# EAGLE design fri3d-badge-2018 (EAGLE 8.5.1)
CNAME: Fri3d Camp Badge; CREVISION: 1.0; DESIGNER: Christophe VG

## Sheet 1 of 2
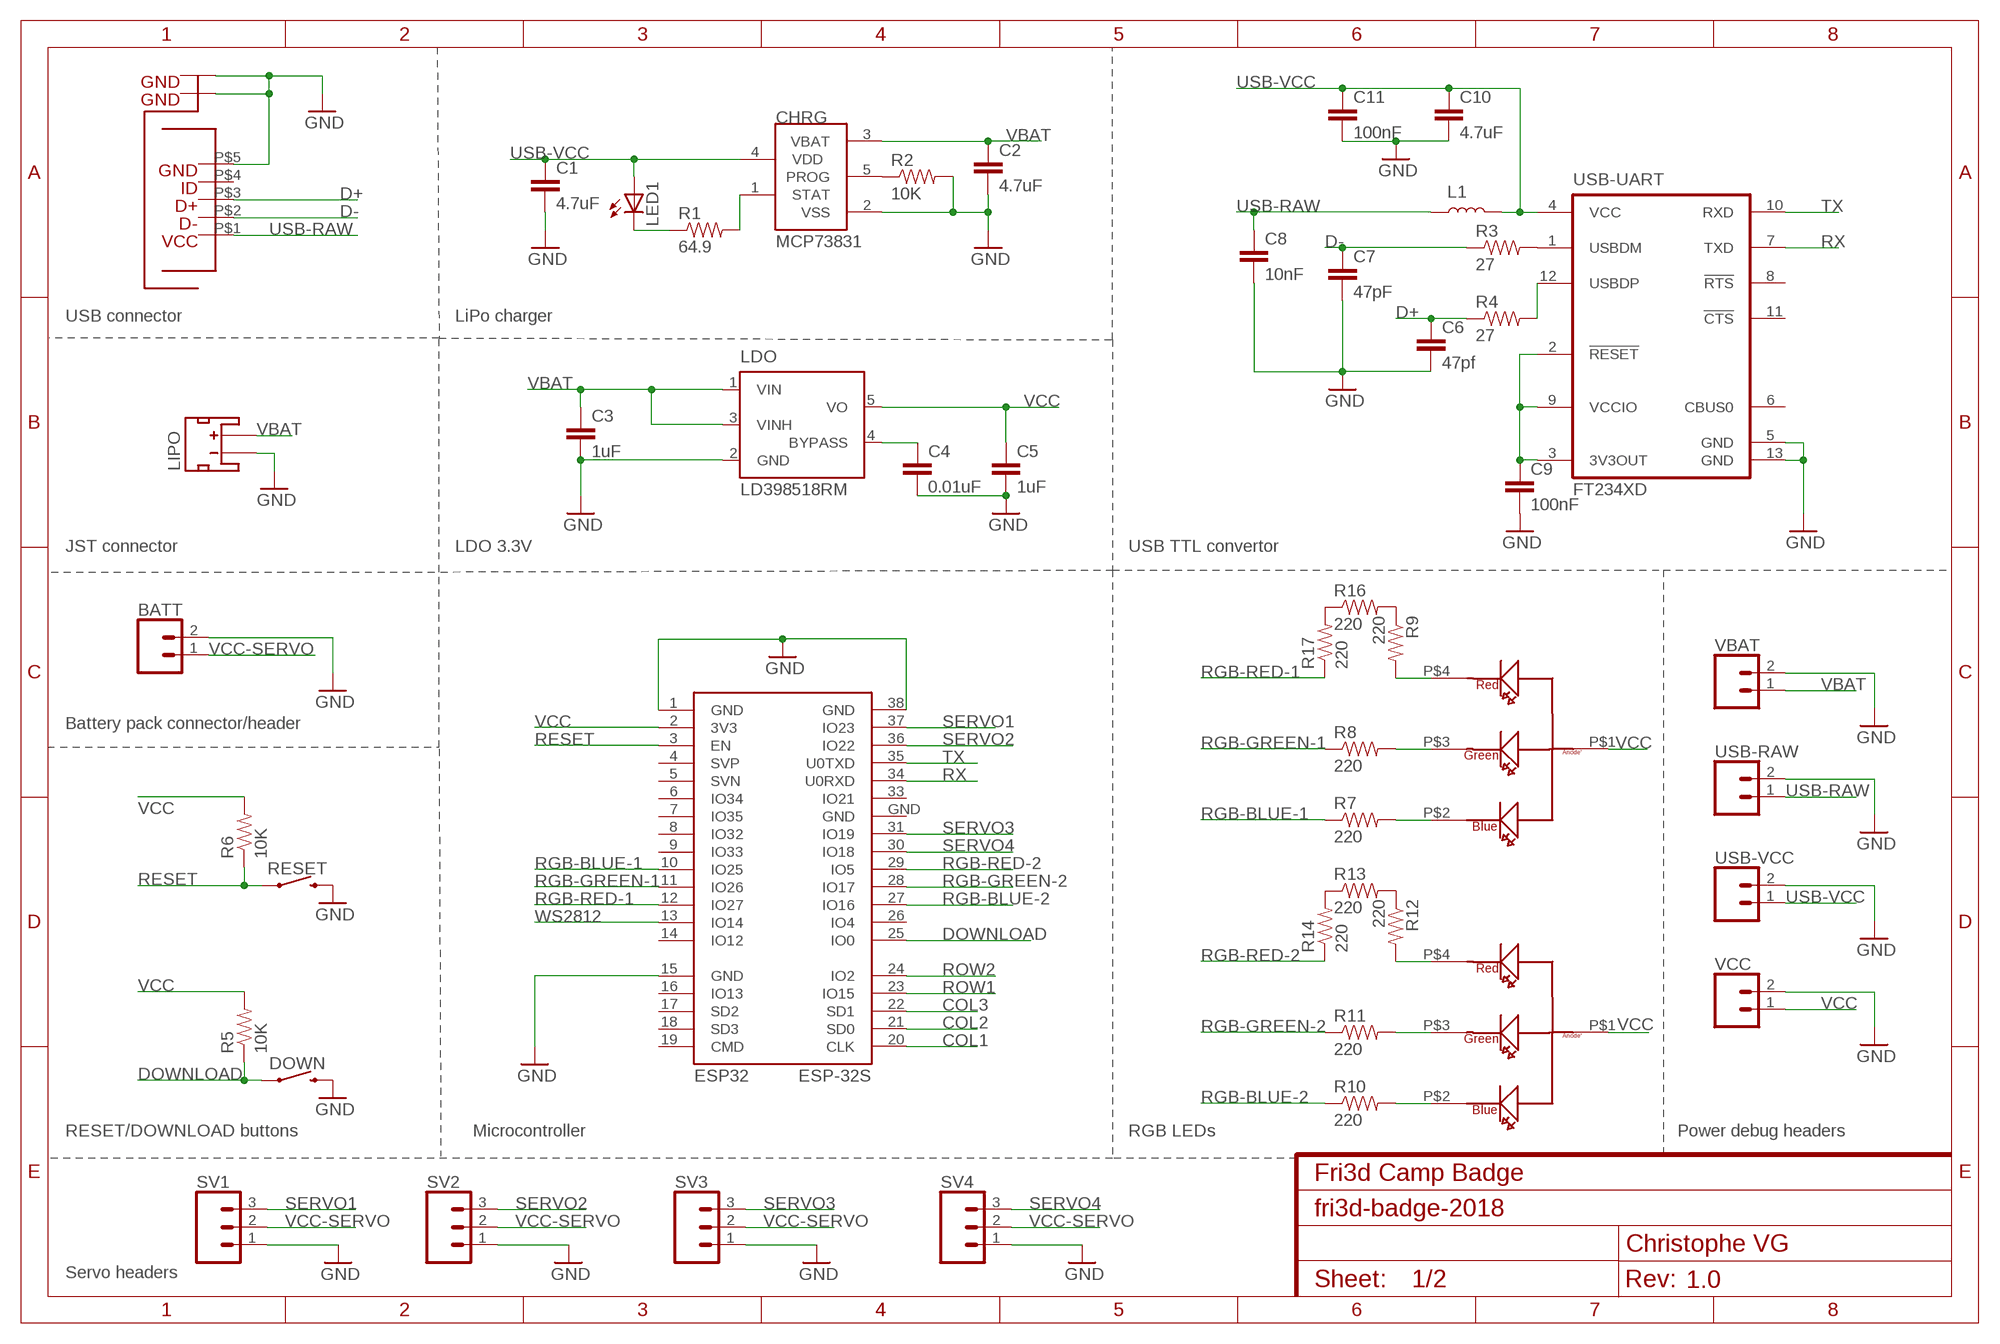
[diagram p0: schematic, sheet 1]

### Parts
BATT  CONN_02  [1X02]
C1  4.7uF  CAP0805  [0805]
C2  4.7uF  CAP0805  [0805]
C3  1uF  CAP0805  [0805]
C4  0.01uF  CAP0805  [0805]
C5  1uF  CAP0805  [0805]
C6  47pf  CAP0805  [0805]
C7  47pF  CAP0805  [0805]
C8  10nF  CAP0805  [0805]
C9  100nF  CAP0805  [0805]
C10  4.7uF  CAP0805  [0805]
C11  100nF  CAP0805  [0805]
CHRG  MCP73831  [SOT23-5L]
DOWN  MOMENTARY-SWITCH-SPST-PTH-6.0MM  [TACTILE_SWITCH_PTH_6.0MM]
ESP32  ESP-32S  [ESP-32S]
L1  INDUCTOR-0805-3.3UH  [0805]
LDO  LD398518RM  [SOT23-5L]
LED1  LEDCHIP-LED0805  [CHIP-LED0805]
LIPO  JST_2MM_MALE  [JST-2-SMD]
R1  64.9  RESISTOR0805-RES  [0805]
R2  10K  RESISTOR0805-RES  [0805]
R3  27  RESISTOR0805-RES  [0805]
R4  27  RESISTOR0805-RES  [0805]
R5  10K  RESISTOR0805-RES  [0805]
R6  10K  RESISTOR0805-RES  [0805]
R7  220  RESISTOR0805-RES  [0805]
R8  220  RESISTOR0805-RES  [0805]
R9  220  RESISTOR0805-RES  [0805]
R10  220  RESISTOR0805-RES  [0805]
R11  220  RESISTOR0805-RES  [0805]
R12  220  RESISTOR0805-RES  [0805]
R13  220  RESISTOR0805-RES  [0805]
R14  220  RESISTOR0805-RES  [0805]
R16  220  RESISTOR0805-RES  [0805]
R17  220  RESISTOR0805-RES  [0805]
RESET  MOMENTARY-SWITCH-SPST-PTH-6.0MM  [TACTILE_SWITCH_PTH_6.0MM]
SV1  CONN_03  [1X03]
SV2  CONN_03  [1X03]
SV3  CONN_03  [1X03]
SV4  CONN_03  [1X03]
U$1  DRAGAN-PERSONAL_AVAGO-RGB-LED  [DRAGAN-PERSONAL_AVAGO-RGB-LED]
U$4  DRAGAN-PERSONAL_AVAGO-RGB-LED  [DRAGAN-PERSONAL_AVAGO-RGB-LED]
U$5  OCTA-CORE_MCIRO-USB2MOUSER  [OCTA-CORE_MICRO-USB2]
USB-RAW  CONN_02  [1X02]
USB-UART  FT234XD  [DFN12]
USB-VCC  CONN_02  [1X02]
VBAT  CONN_02  [1X02]
VCC  CONN_02  [1X02]

### Nets
COL1: ESP32.20(CLK) ; also sheet 2
COL2: ESP32.21(SD0) ; also sheet 2
COL3: ESP32.22(SD1) ; also sheet 2
D+: C6.1 R4.1 U$5.P$3
D-: C7.1 R3.1 U$5.P$2
DOWNLOAD: DOWN.1 ESP32.25(IO0) R5.1
GND: BATT.2 C1.2 C2.2 C3.2 C4.2 C5.2 C6.2 C7.2 C8.2 C9.2 C10.2 C11.2 CHRG.2(VSS) DOWN.3 ESP32.1(GND) ESP32.15(GND) ESP32.38(GND) LDO.2(GND) LIPO.1(-) R2.2 RESET.3 SV1.1 SV2.1 SV3.1 SV4.1 U$5.P$5 U$5.P$6 U$5.P$7 U$5.P$8 U$5.P$9 U$5.P$10 U$5.P$11 U$5.P$12 U$5.P$13 USB-RAW.2 USB-UART.5(GND) USB-UART.13(GND) USB-VCC.2 VBAT.2 VCC.2 ; also sheet 2
N$1: CHRG.5(PROG) R2.1
N$2: R3.2 USB-UART.1(USBDM)
N$3: CHRG.1(STAT) R1.2
N$4: LED1.C R1.1
N$5: R4.2 USB-UART.12(USBDP)
N$6: C9.1 USB-UART.2(!RESET!) USB-UART.3(3V3OUT) USB-UART.9(VCCIO)
N$7: C4.1 LDO.4(BYPASS)
N$8: R12.1 R13.2
N$9: R13.1 R14.2
N$10: R11.2 U$1.P$3
N$11: R9.1 R16.2
N$12: R16.1 R17.2
N$13: R12.2 U$1.P$4
N$14: R10.2 U$1.P$2
N$18: R9.2 U$4.P$4
N$19: R8.2 U$4.P$3
N$20: R7.2 U$4.P$2
RESET: ESP32.3(EN) R6.1 RESET.1
RGB-BLUE-1: ESP32.10(IO25) R7.1
RGB-BLUE-2: ESP32.27(IO16) R10.1
RGB-GREEN-1: ESP32.11(IO26) R8.1
RGB-GREEN-2: ESP32.28(IO17) R11.1
RGB-RED-1: ESP32.12(IO27) R17.1
RGB-RED-2: ESP32.29(IO5) R14.1
ROW1: ESP32.23(IO15) ; also sheet 2
ROW2: ESP32.24(IO2) ; also sheet 2
RX: ESP32.34(U0RXD) USB-UART.7(TXD)
SERVO1: ESP32.37(IO23) SV1.3
SERVO2: ESP32.36(IO22) SV2.3
SERVO3: ESP32.31(IO19) SV3.3
SERVO4: ESP32.30(IO18) SV4.3
TX: ESP32.35(U0TXD) USB-UART.10(RXD)
USB-RAW: C8.1 L1.1 U$5.P$1 USB-RAW.1
USB-VCC: C1.1 C10.1 C11.1 CHRG.4(VDD) L1.2 LED1.A USB-UART.4(VCC) USB-VCC.1
VBAT: C2.1 C3.1 CHRG.3(VBAT) LDO.1(VIN) LDO.3(VINH) LIPO.2(+) VBAT.1
VCC: C5.1 ESP32.2(3V3) LDO.5(VO) R5.2 R6.2 U$1.P$1 U$4.P$1 VCC.1 ; also sheet 2
VCC-SERVO: BATT.1 SV1.2 SV2.2 SV3.2 SV4.2
WS2812: ESP32.13(IO14) ; also sheet 2
Unconnected: ESP32.4(SVP) ESP32.5(SVN) ESP32.6(IO34) ESP32.7(IO35) ESP32.8(IO32) ESP32.9(IO33) ESP32.14(IO12) ESP32.16(IO13) ESP32.17(SD2) ESP32.18(SD3) ESP32.19(CMD) ESP32.26(IO4) ESP32.33(IO21) LIPO.NC1(PAD1) LIPO.NC2(PAD2) U$5.P$4 USB-UART.6(CBUS0) USB-UART.8(!RTS!) USB-UART.11(!CTS!)

### Notes on the sheet
- USB connector | LiPo charger
- JST connector | LDO 3.3V | USB TTL convertor
- Battery pack connector/header
- RESET/DOWNLOAD buttons | Microcontroller | RGB LEDs | Power debug headers
- Servo headers

## Sheet 2 of 2
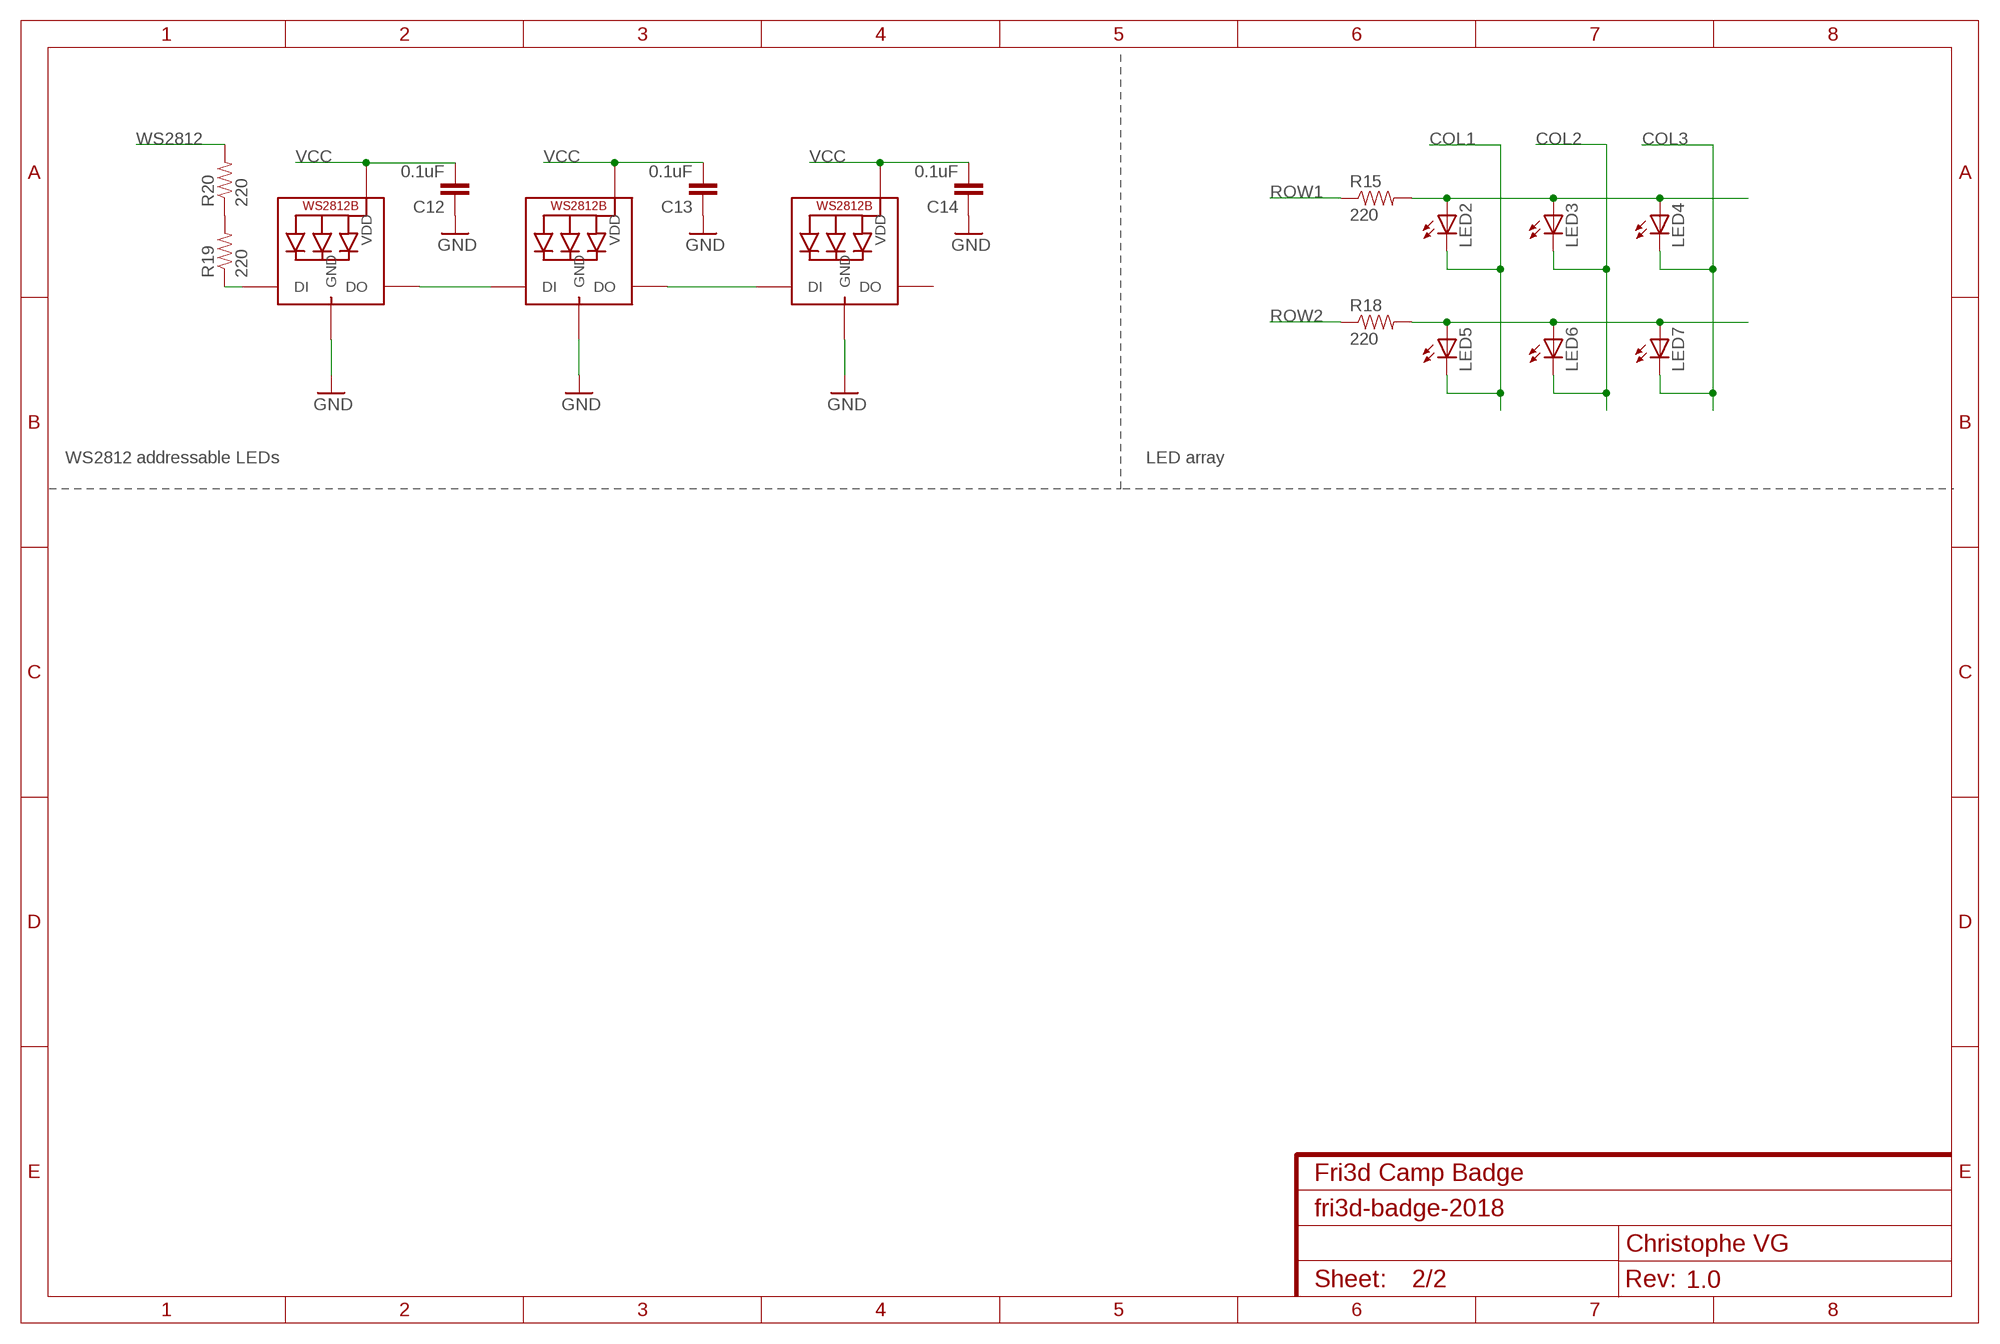
[diagram p1: schematic, sheet 2]

### Parts
C12  0.1uF  CAP0805  [0805]
C13  0.1uF  CAP0805  [0805]
C14  0.1uF  CAP0805  [0805]
LED2  LEDCHIP-LED0805  [CHIP-LED0805]
LED3  LEDCHIP-LED0805  [CHIP-LED0805]
LED4  LEDCHIP-LED0805  [CHIP-LED0805]
LED5  LEDCHIP-LED0805  [CHIP-LED0805]
LED6  LEDCHIP-LED0805  [CHIP-LED0805]
LED7  LEDCHIP-LED0805  [CHIP-LED0805]
R15  220  RESISTOR0805-RES  [0805]
R18  220  RESISTOR0805-RES  [0805]
R19  220  RESISTOR0805-RES  [0805]
R20  220  RESISTOR0805-RES  [0805]
WS1  WS2812B5050  [WS2812B]
WS2  WS2812B5050  [WS2812B]
WS3  WS2812B5050  [WS2812B]

### Nets
COL1: LED2.C LED5.C ; also sheet 1
COL2: LED3.C LED6.C ; also sheet 1
COL3: LED4.C LED7.C ; also sheet 1
GND: C12.1 C13.1 C14.1 WS1.3-GND(GND) WS2.3-GND(GND) WS3.3-GND(GND) ; also sheet 1
N$15: WS1.2-DOUT(DO) WS2.4-DIN(DI)
N$16: WS2.2-DOUT(DO) WS3.4-DIN(DI)
N$17: LED2.A LED3.A LED4.A R15.2
N$21: LED5.A LED6.A LED7.A R18.2
N$23: R19.1 WS1.4-DIN(DI)
N$24: R19.2 R20.1
ROW1: R15.1 ; also sheet 1
ROW2: R18.1 ; also sheet 1
VCC: C12.2 C13.2 C14.2 WS1.1-VDD(VDD) WS2.1-VDD(VDD) WS3.1-VDD(VDD) ; also sheet 1
WS2812: R20.2 ; also sheet 1
Unconnected: WS3.2-DOUT(DO)

### Notes on the sheet
- WS2812 addressable LEDs | LED array

## Power pins joined to a net without a drawn wire
GND: ESP32.GND

## Library data of the parts
BATT USB-RAW USB-VCC VBAT VCC = SparkFun-Connectors:CONN_02: Multi connection point. Often used as Generic Header-pin footprint for 0.1 inch spaced/style header connections On any of the 0.1 inch spaced packages, you can populate with these: Break Away Headers - Straight <https://www.sparkfun.com/products/116> (PRT-00116) Break Away Male Headers - Right Angle <https://www.sparkfun.com/products/553> (PRT-00553) Female Headers <https://www.sparkfun.com/products/115> (PRT-00115) Break Away Headers - Machine Pin <https://www.sparkfun.com/products/117> (PRT-00117) Break Away Female Headers - Swiss Machine Pin <https://www.sparkfun.com/products/743> (PRT-00743) For SCREWTERMINALS and SPRING TERMINALS visit here: Screw Terimnals on SparkFun.com <https://www.sparkfun.com/search/results?term=Screw+Terminals> (5mm/3.5mm/2.54mm spacing) This device is also useful as a general connection point to wire up your design to another part of your project. Our various solder wires solder well into these plated through hole pads. Hook-Up Wire - Assortment (Stranded, 22 AWG) <https://www.sparkfun.com/products/11375> (PRT-11375) Hook-Up Wire - Assortment (Solid Core, 22 AWG) <https://www.sparkfun.com/products/11367> (PRT-11367) View the entire wire category on our website here <https://www.sparkfun.com/categories/141> Special notes: Molex polarized connector foot print use with: PRT-08233 with associated crimp pins and housings. 2.54_SCREWTERM for use with PRT-10571. 3.5mm Screw Terminal footprints for PRT-08084 5mm Screw Terminal footprints for use with PRT-08432
C1-C14 = passive:CAP: Capacitor Standard 0603 ceramic capacitor, and 0.1" leaded capacitor.
CHRG = microchip-update:MCP73831: Miniature Single-Cell, Fully Integrated Li-Ion, Li-Polymer Charge Management Controllers
DOWN RESET = SparkFun-Switches:MOMENTARY-SWITCH-SPST: Momentary Switch (Pushbutton) - SPST Normally-open (NO) SPST momentary switches (buttons, pushbuttons). Variants PTH-12MM - 12mm square, through-hole Momentary Pushbutton Switch - 12mm Square <https://www.sparkfun.com/products/9190> (COM-09190) PTH-6.0MM, PTH-6.0MM-KIT - 6.0mm square, through-hole Mini Pushbutton Switch <https://www.sparkfun.com/products/97> (COM-00097) KIT package intended for soldering kit's - only one side of pads' copper is exposed. PTH-RIGHT-ANGLE-KIT - Right-angle, through-hole Right Angle Tactile Button <https://www.sparkfun.com/products/10791> - Used on SparkFun BigTime Watch Kit <https://www.sparkfun.com/products/11734> SMD-12MM - 12mm square, surface-mount Tactile Button - SMD (12mm) <https://www.sparkfun.com/products/12993> (COM-12993) Used on SparkFun PicoBoard <https://www.sparkfun.com/products/11888> SMD-4.5MM - 4.5mm Square Trackball Switch Used on SparkFun Blackberry Trackballer Breakout <https://www.sparkfun.com/products/13169> SMD-4.6MMX2.8MM - 4.60mm x 2.80mm, surface mount Used on SparkFun SAMD21 Mini Breakout <https://www.sparkfun.com/products/13664> SMD-5.2MM, SMD-5.2-REDUNDANT - 5.2mm square, surface-mount Mini Pushbutton Switch - SMD <https://www.sparkfun.com/products/8720> (COM-08720) Used on Arduino Pro Mini <https://www.sparkfun.com/products/11114> REDUNDANT package connects both switch circuits together SMD-6.0X3.5MM - 6.0 x 3.5mm, surface mount Momentary Reset Switch SMD <https://www.sparkfun.com/products/8229> (COM-08229) SMD-6.2MM-TALL - 6.2mm square, surface mount Tactile Button - SMD (6mm) <https://www.sparkfun.com/products/12992> Used on SparkFun Digital Sandbox <https://www.sparkfun.com/products/12651> SMD-RIGHT-ANGLE - Right-angle, surface mount Used on SparkFun Block for Intel® Edison - Arduino <https://www.sparkfun.com/products/13036>; PROD_ID: SWCH-08441; SF_SKU: COM-00097
ESP32 = esp32:ESP-32S: Ai-Thinker ESP-32S
L1 = SparkFun-Coils:INDUCTOR: Inductors Resist changes in electrical current. Basically a coil of wire. SparkFun Products: SparkFun Load Cell Amplifier - HX711 <https://www.sparkfun.com/products/13879> IOIO-OTG - V2.2 <https://www.sparkfun.com/products/13613>; PROD_ID: NDUC-13076; VALUE: 3.3µH/±20%/450mA
LDO = st-microelectronics:LD3985: Ultra low drop and low noise BiCMOS voltage regulators Source: www.st.com LD3985.pdf
LED1-LED7 = led:LED: LED
LIPO = SparkFun-Connectors:JST_2MM_MALE: JST 2MM MALE RA CONNECTOR Two pin, compact surface mount connector. Commonly used as a battery input connection point. We really like the solid locking feeling and high current rating on these small connectors. We use these all the time as battery connectors. Mates to single-cell LiPo batteries. Here is the connector we sell at SparkFun: JST Right Angle Connector - White <https://www.sparkfun.com/products/8612> (PRT-08612) Datasheet <http://www.sparkfun.com/datasheets/Prototyping/Connectors/JST-Horizontal.pdf> It was used on these SparkFun products: SparkFun MOSFET Power Controller <https://www.sparkfun.com/products/11214> (PRT-11214) SparkFun Battery Babysitter - LiPo Battery Manager <https://www.sparkfun.com/products/13777> (PRT-13777) And many, many others that required a lipo battery connection.; PROD_ID: CONN-11443; SF_ID: PRT-08612
R1-R20 = passive:RESISTOR: Resistor Basic schematic elements and footprints for 0603, 1206, and PTH resistors.
SV1-SV4 = SparkFun-Connectors:CONN_03: Multi connection point. Often used as Generic Header-pin footprint for 0.1 inch spaced/style header connections On any of the 0.1 inch spaced packages, you can populate with these: Break Away Headers - Straight <https://www.sparkfun.com/products/116> (PRT-00116) Break Away Male Headers - Right Angle <https://www.sparkfun.com/products/553> (PRT-00553) Female Headers <https://www.sparkfun.com/products/115> (PRT-00115) Break Away Headers - Machine Pin <https://www.sparkfun.com/products/117> (PRT-00117) Break Away Female Headers - Swiss Machine Pin <https://www.sparkfun.com/products/743> (PRT-00743) Stackable Header - 3 Pin (Female, 0.1") <https://www.sparkfun.com/products/13875> (PRT-13875) For SCREWTERMINALS and SPRING TERMINALS visit here: Screw Terimnals on SparkFun.com <https://www.sparkfun.com/search/results?term=Screw+Terminals> (5mm/3.5mm/2.54mm spacing) This device is also useful as a general connection point to wire up your design to another part of your project. Our various solder wires solder well into these plated through hole pads. Hook-Up Wire - Assortment (Stranded, 22 AWG) <https://www.sparkfun.com/products/11375> (PRT-11375) Hook-Up Wire - Assortment (Solid Core, 22 AWG) <https://www.sparkfun.com/products/11367> (PRT-11367) View the entire wire category on our website here <https://www.sparkfun.com/categories/141> Special notes: Molex polarized connector foot print use with SKU : PRT-08232 with associated crimp pins and housings.
U$1 U$4 = Badge_EZR_V1:DRAGAN-PERSONAL_AVAGO-RGB-LED
U$5 = OCTA-EZR_v1:OCTA-CORE_MCIRO-USB2: Micr MICRO USB TYPE B RCPT W/ REAR PEGS. Mouser: 649-10118194-0001LF
USB-UART = ftdi-chip:FT234XD: USB TO BASIC UART IC
WS1-WS3 = adafruit:WS2812B

## Board
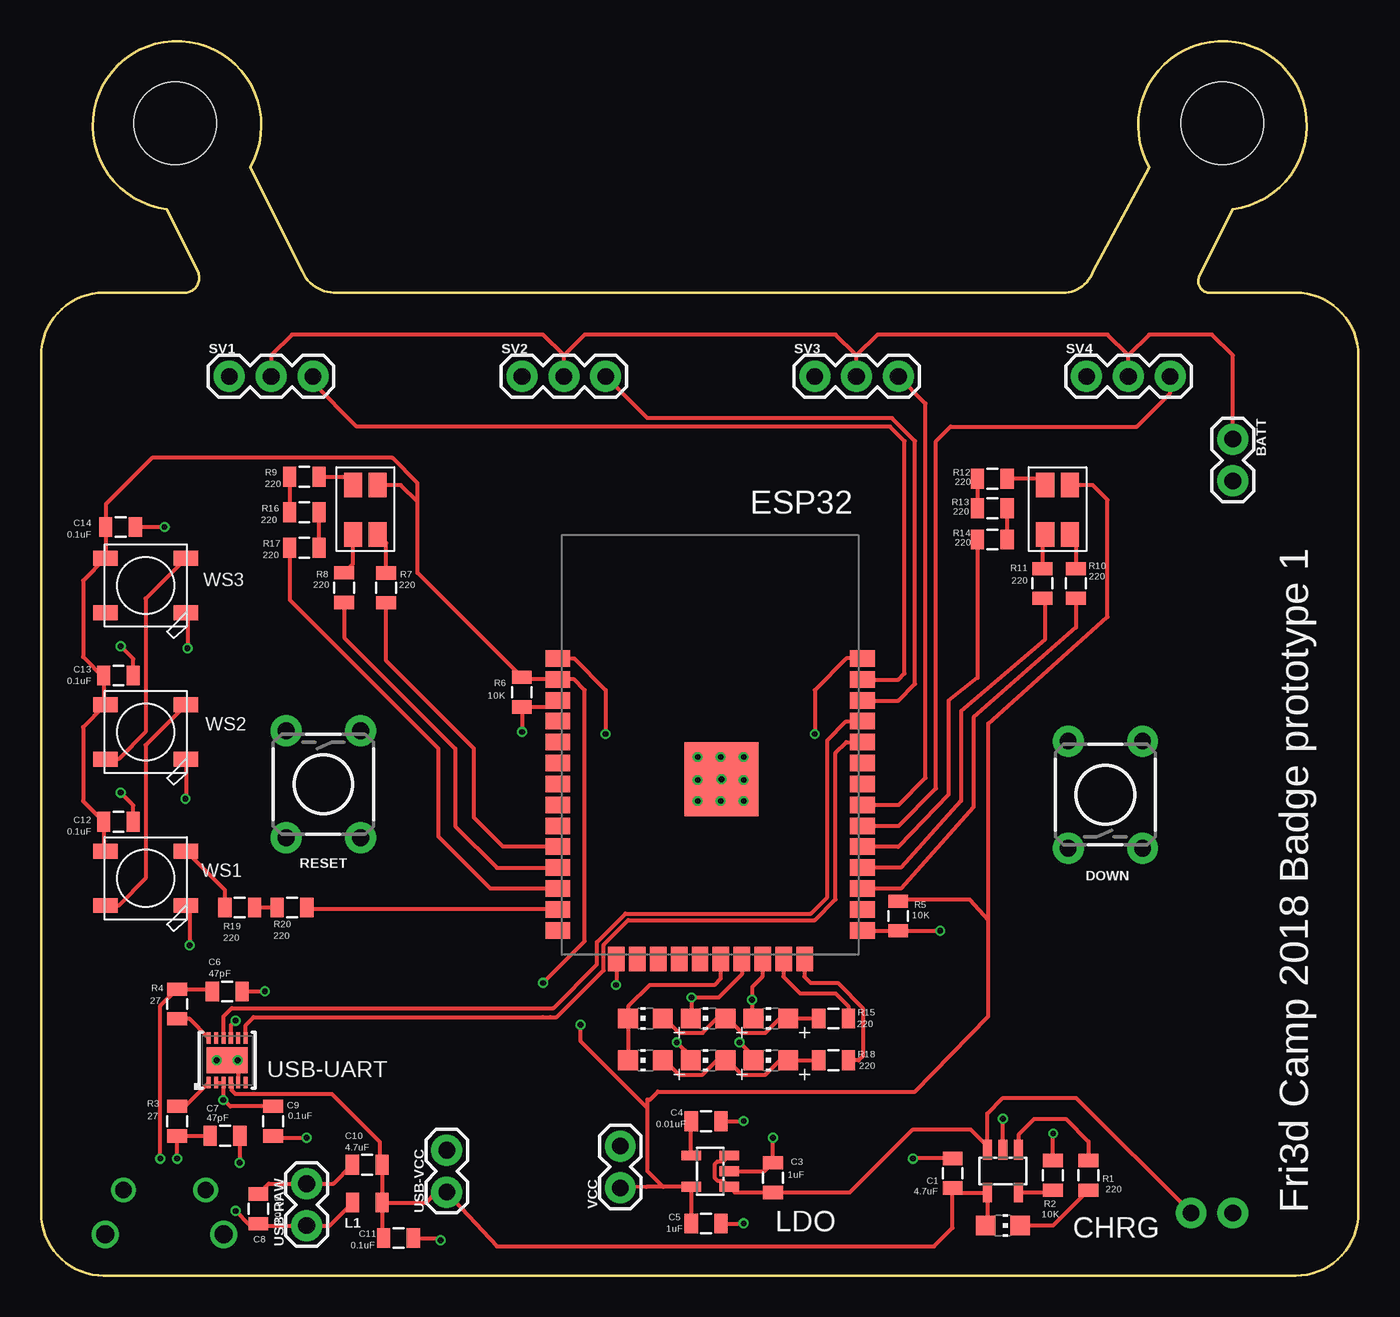
[diagram p2: board, top side]
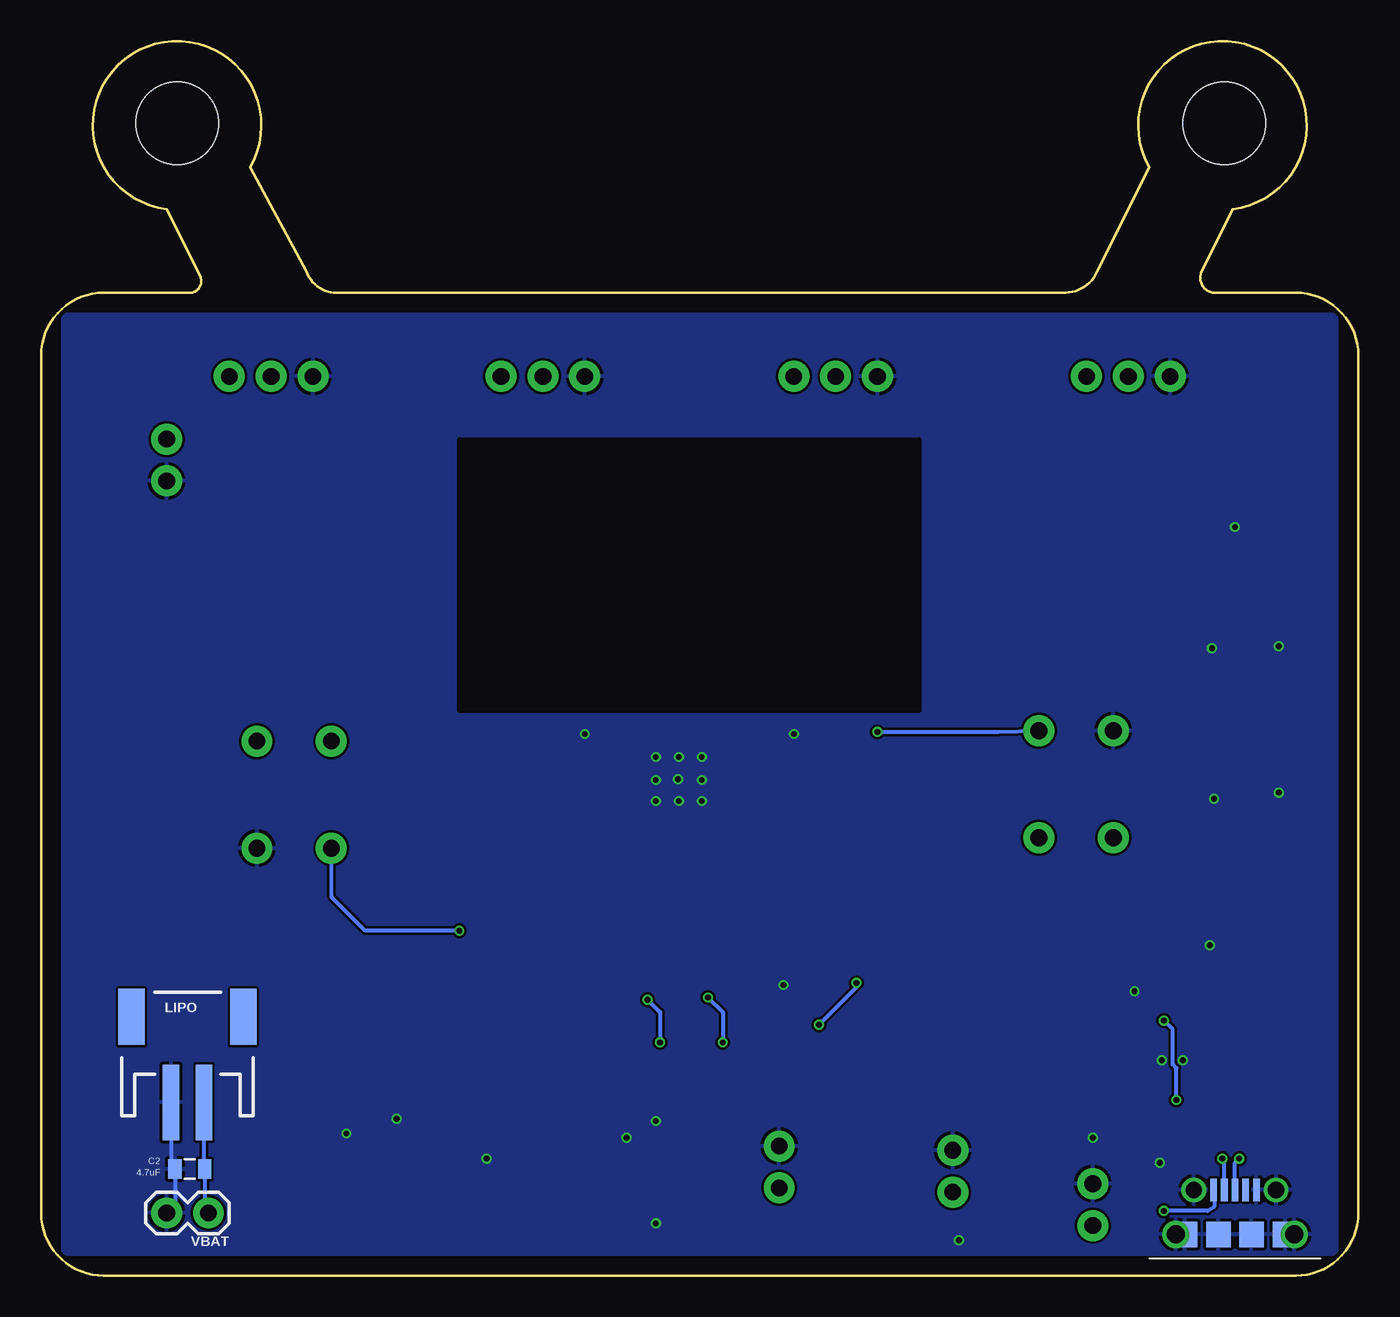
[diagram p3: board, bottom side, seen from below]

Size 80.01 x 74.96 mm. Coordinates in mm from the lower left corner, seen from the top.
Outline: 0,55.88 arc-90 3.81,59.69 8.76,59.69 arc111 9.53,60.96 7.62,64.77 arc-293 12.7,67.31 15.88,60.96 arc64 17.78,59.69 62.23,59.69 arc65 63.88,60.96 67.31,67.31 arc-293 72.39,64.77 70.36,60.71 arc127 71.12,59.69 76.2,59.69 arc-90 80.01,55.88 80.01,3.81 arc-90 76.2,0 3.81,0 arc-90 0,3.81 0,55.88
Copper layers (1*16): Top 0.018mm / dielectric 1.55mm / Bottom 0.018mm
Design rules "eC_2Layer_PClass6_BaseCopperO18_eCDefault": minimum track width 0.15mm, minimum drill 0.35mm, track to track 0.15mm, track to pad 0.15mm, pad to pad 0.15mm, via to via 0.15mm, smd to smd 0mil, copper to edge 0.25mm, drill to drill 0.35mm, minimum pad ring 0.175mm, minimum via ring 0.125mm, stop-mask expansion 0mil, vias tented up to drill 0.45mm, thermal gap 0.2mm
Holes 5 mm at 8.13,69.98 71.75,69.98

### Footprints (pad centres in the part's own frame; a part is rotated, then mirrored left to right if it is on the bottom)
1X02 = drill 1.016 pad 1.88: 1 0,0; 2 2.54,0
0805 = smd 0.8 x 1.2: 1 -0.9,0; 2 0.9,0
SOT23-5L = smd 0.55 x 1.2: 1 -0.95,-1.3; 2 0,-1.3; 3 0.95,-1.3; 4 0.95,1.3; 5 -0.95,1.3
TACTILE_SWITCH_PTH_6.0MM = drill 1.016 pad 1.88: 1 -3.251,2.261; 2 3.251,2.261; 3 -3.251,-2.261; 4 3.251,-2.261
ESP-32S = smd 1.5 x 1: 1 -9.25,7; 2 -9.25,5.73; 3 -9.25,4.46; 4 -9.25,3.19; 5 -9.25,1.92; 6 -9.25,0.65; 7 -9.25,-0.62; 8 -9.25,-1.89; 9 -9.25,-3.16; 10 -9.25,-4.43; 11 -9.25,-5.7; 12 -9.25,-6.97; 13 -9.25,-8.24; 14 -9.25,-9.51; 25 9.25,-9.51; 26 9.25,-8.24; 27 9.25,-6.97; 28 9.25,-5.7; 29 9.25,-4.43; 30 9.25,-3.16; 31 9.25,-1.89; 32 9.25,-0.62; 33 9.25,0.65; 34 9.25,1.92; 35 9.25,3.19; 36 9.25,4.46; 37 9.25,5.73; 38 9.25,7 | smd 1 x 1.5: 15 -5.7,-11.25; 16 -4.43,-11.25; 17 -3.16,-11.25; 18 -1.89,-11.25; 19 -0.62,-11.25; 20 0.65,-11.25; 21 1.92,-11.25; 22 3.19,-11.25; 23 4.46,-11.25; 24 5.73,-11.25 | smd 4.5 x 4.5: GND 0.68,-0.33
SOT23-5L' = smd 0.6 x 1.2: 1 -0.95,-1.15; 2 0,-1.15; 3 0.95,-1.15; 4 0.95,1.15; 5 -0.95,1.15
CHIP-LED0805 = smd 1.2 x 1.2: A 0,-1.05; C 0,1.05
JST-2-SMD = smd 1 x 4.6: 1 -1,-3.7; 2 1,-3.7 | smd 1.6 x 3.4: NC1 -3.4,1.5; NC2 3.4,1.5
1X03 = drill 1.016 pad 1.88: 1 0,0; 2 2.54,0; 3 5.08,0
DRAGAN-PERSONAL_AVAGO-RGB-LED = smd 1.1 x 1.5: P$1 0,0; P$2 0,3; P$3 1.5,3; P$4 1.5,0
OCTA-CORE_MICRO-USB2 = smd 0.4 x 1.35: P$1 -1.3,0; P$2 -0.65,0; P$3 0,0; P$4 0.65,0; P$5 1.3,0 | drill 1 pad 1.5: P$6 -2.5,0; P$7 2.5,0 | smd 1.5 x 1.55: P$8 1,-2.7; P$9 -1,-2.7; P$10 -3.05,-2.7; P$11 3.05,-2.7 | drill 1.1 pad 1.6: P$12 -3.6,-2.7; P$13 3.6,-2.7
DFN12 = smd 0.7 x 0.25: 1 -1.35,1.125; 2 -1.35,0.675; 3 -1.35,0.225; 4 -1.35,-0.225; 5 -1.35,-0.675; 6 -1.35,-1.125; 7 1.35,-1.125; 8 1.35,-0.675; 9 1.35,-0.225; 10 1.35,0.225; 11 1.35,0.675; 12 1.35,1.125 | smd 1.6 x 2.5: 13 0,0
WS2812B = smd 1.5 x 0.9: 1-VDD 2.45,-1.65; 2-DOUT 2.45,1.65; 3-GND -2.45,1.65; 4-DIN -2.45,-1.65

### Placement (x,y rotation side)
BATT  72.39,50.8 270 top
C1  55.36,6.22 90 top
C2  70.98,6.48 180 bottom
C3  44.45,5.96 90 top
C4  40.39,9.39 0 top
C5  40.39,3.16 0 top
C6  47pF  [0805]  11.3,17.26 0 top
C7  11.18,8.5 0 top
C8  0.01uF  [0805]  13.2,4.06 90 top
C9  0.1uF  [0805]  14.1,9.39 270 top
C10  19.8,6.73 180 top
C11  0.1uF  [0805]  21.71,2.29 0 top
C12  4.7,27.56 180 top
C13  4.7,36.45 180 top
C14  4.83,45.47 180 top
CHRG  58.42,6.35 180 top
DOWN  64.64,29.21 90 top
ESP32  40.64,30.48 0 top
L1  19.81,4.45 0 top
LDO  LD398518RM  [SOT23-5L']  40.64,6.35 90 top
LED1  58.42,3.05 270 top
LED2  36.7,15.62 90 top
LED3  40.51,15.62 90 top
LED4  44.32,15.62 90 top
LED5  36.7,13.08 90 top
LED6  40.51,13.08 90 top
LED7  44.32,13.08 90 top
LIPO  71.12,14.22 0 bottom
R1  220  [0805]  63.62,6.1 90 top
R2  61.46,6.1 90 top
R3  8.26,9.39 90 top
R4  8.26,16.5 270 top
R5  52.06,21.84 90 top
R6  29.2,35.43 90 top
R7  20.95,41.77 90 top
R8  18.4,41.78 90 top
R9  15.99,48.51 0 top
R10  62.85,42.04 90 top
R11  60.82,42.04 90 top
R12  57.77,48.39 0 top
R13  57.77,46.61 180 top
R14  57.77,44.7 0 top
R15  48.13,15.62 180 top
R16  15.99,46.35 180 top
R17  15.99,44.2 0 top
R18  48.13,13.08 180 top
R19  12.06,22.35 0 top
R20  15.24,22.35 0 top
RESET  17.14,29.84 270 top
SV1  11.43,54.61 0 top
SV2  29.21,54.61 0 top
SV3  46.99,54.61 0 top
SV4  63.5,54.61 0 top
U$1  62.48,48.01 180 top
U$4  20.45,48.01 180 top
U$5  7.49,5.21 0 bottom
USB-RAW  16.13,3.05 90 top
USB-UART  11.3,13.08 90 top
USB-VCC  24.64,5.08 90 top
VBAT  69.85,3.81 180 bottom
VCC  35.18,5.33 90 top
WS1  6.35,24.13 180 top
WS2  6.35,33.02 180 top
WS3  6.35,41.91 180 top

### Tracks (layer width: path | path; a pad name or v marks a point on that pad's centre or on a via)
COL1
  Top 0.254: LED5.C LED2.C 35.65,16.35 36.96,17.65 40.89,17.65 41.27,18.03 41.27,19.21 ESP32.20
COL2  (via drill 0.35)
  Top 0.254: ESP32.21 42.56,18.3 41.15,16.89 v39.5,16.89 39.5,15.65 LED3.C | v38.61,14.17 39.46,13.31 LED6.C
  Bottom 0.254: v39.5,16.89 38.61,16 v38.61,14.17
COL3  (via drill 0.35)
  Top 0.254: ESP32.22 43.81,19.21 43.81,18.16 43.18,17.53 v43.18,16.76 43.18,15.71 LED4.C | v42.42,14.17 43.27,13.31 LED7.C
  Bottom 0.254: v43.18,16.76 42.42,16 v42.42,14.17
D+  (via drill 0.35)
  Top 0.254: C6.1 10.27,17.4 R4.1 7.24,16.38 v7.24,7.11
  Bottom 0.254: U$5.P$3 7.49,6.86 v7.24,7.11
D-  (via drill 0.35)
  Top 0.254: C7.1 R3.1 v8.26,7.11
  Bottom 0.254: U$5.P$2 8.14,7 v8.26,7.11
DOWNLOAD  (via drill 0.35)
  Top 0.254: ESP32.25 49.92,20.94 R5.1 54.6,20.94 v54.61,20.95
  Bottom 0.254: v54.61,20.95 60.33,20.95 62.36,22.99 62.36,25.93 DOWN.1
GND  (via drill 0.35)
  Top 0.254: C1.2 52.97,7.12 v52.96,7.11 | CHRG.2 v58.42,9.53 | R2.2 61.46,8.62 v61.47,8.64 | LDO.2 43.94,6.35 C3.2 v44.45,8.38 | C5.2 42.29,3.15 v42.67,3.17 | USB-UART.5 11.98,12.41 USB-UART.13 | USB-UART.13 v10.67,13.08 | USB-UART.13 v11.94,13.08 | C10.2 17.76,5.59 USB-RAW.2 13.82,5.59 C8.2 | C11.2 24.13,2.29 v24.26,2.16 | C9.2 14.2,8.38 v16.13,8.38 | C7.2 12.06,8.49 v12.06,6.86 | C6.2 13.58,17.26 v13.59,17.27 | ESP32.15 34.94,17.67 v34.92,17.65 | ESP32.GND 41.22,30.15 v39.88,31.5 | ESP32.GND 41.32,31.45 v41.27,31.5 | ESP32.GND v42.67,31.5 | ESP32.GND 39.93,30.15 v39.88,30.1 | ESP32.GND 42.62,30.15 v42.67,30.1 | ESP32.GND 40,28.83 v39.88,28.83 | ESP32.GND 41.32,28.87 v41.27,28.83 | ESP32.GND 41.35,30.15 v42.67,28.83 | C4.2 42.66,9.39 v42.67,9.4 | WS3.3-GND 8.89,40.17 v8.89,38.1 | WS1.3-GND 9.02,22.01 v9.02,20.07 | ESP32.1 32.37,37.48 34.29,35.56 v34.29,32.89 | ESP32.38 48.91,37.48 46.99,35.56 v46.99,32.89 | WS2.3-GND 8.8,28.99 v8.76,28.96 | C14.1 v7.49,45.47 | C13.1 5.6,37.45 v4.83,38.23 | C12.1 5.6,28.56 v4.83,29.34
  Bottom 0.254: LIPO.1 72.12,6.71 C2.2 71.88,4.32 VBAT.2
  other vias: 41.32,30.15
  pour Bottom (rank 2): 1.27,58.42 1.27,1.27 78.74,1.27 78.74,58.42
N$1
  Top 0.254: 59.31,4.99 CHRG.5 61.31,5.05 R2.1
N$2
  Top 0.254: USB-UART.1 8.73,10.29 R3.2
N$3
  Top 0.254: CHRG.1 59.4,7.62 59.4,8.6 60.33,9.53 62.23,9.53 63.62,8.14 R1.2
N$4
  Top 0.254: R1.1 61.47,3.05 LED1.C
N$5
  Top 0.254: USB-UART.12 9.01,15.6 R4.2
N$6  (via drill 0.35)
  Top 0.254: USB-UART.2 USB-UART.3 11.08,10.7 | 11.08,10.7 v11.05,10.67 | 11.56,14.46 USB-UART.9 11.53,15.21 v11.81,15.49 | C9.1 11.49,10.29 11.08,10.7
  Bottom 0.254: v11.05,10.67 11.05,12.6 11.28,12.83 11.28,14.96 v11.81,15.49
N$7
  Top 0.254: LDO.4 C4.1
N$8
  Top 0.254: R12.1 R13.2
N$9
  Top 0.254: R13.1 R14.2
N$10
  Top 0.254: U$1.P$3 60.82,44.84 R11.2
N$11
  Top 0.254: R9.1 R16.2
N$12
  Top 0.254: R17.2 R16.1
N$13
  Top 0.254: U$1.P$4 60.6,48.39 R12.2
N$14
  Top 0.254: U$1.P$2 62.85,44.64 R10.2
N$15
  Top 0.254: WS2.4-DIN 6.35,32.22 6.35,24.13 4.7,22.48 WS1.2-DOUT
N$16
  Top 0.254: WS3.4-DIN 6.35,41.11 6.35,33.02 4.7,31.37 WS2.2-DOUT
N$17
  Top 0.254: LED2.A 37.87,15.62 38.75,14.74 40.18,14.74 41.05,15.62 LED3.A 41.68,15.62 42.56,14.74 43.99,14.74 44.87,15.62 LED4.A R15.2
N$18
  Top 0.254: R9.2 18.44,48.51 U$4.P$4
N$19
  Top 0.254: R8.2 18.95,43.23 U$4.P$3
N$20
  Top 0.254: R7.2 20.95,44.5 U$4.P$2
N$21
  Top 0.254: LED5.A 37.87,13.08 38.75,12.2 40.18,12.2 41.05,13.08 LED6.A 41.68,13.08 42.56,12.2 43.99,12.2 44.87,13.08 LED7.A R18.2
N$22
  cutout Bottom: 26.67,50.8 26.67,34.29 54.61,34.29 54.61,50.8
N$23
  Top 0.254: R19.1 11.16,23.41 WS1.4-DIN
N$24
  Top 0.254: R20.1 R19.2
RESET  (via drill 0.35)
  Top 0.254: ESP32.3 30.98,34.53 R6.1 v29.2,33.03 v29.21,33.02
  Bottom 0.254: v29.21,33.02 21.87,33.02 RESET.1
RGB-BLUE-1
  Top 0.254: ESP32.10 28.05,26.05 26.29,27.81 26.29,32 20.95,37.34 R7.1
RGB-BLUE-2
  Top 0.254: R10.1 62.87,41.13 62.87,39.37 56.64,33.91 56.64,28.45 52.21,23.51 ESP32.27
RGB-GREEN-1
  Top 0.254: R8.1 18.4,38.75 25.15,32 25.15,27.3 27.69,24.77 31.38,24.77 ESP32.11
RGB-GREEN-2
  Top 0.254: R11.1 60.96,41 60.96,38.61 55.88,34.29 55.88,28.83 52.21,24.78 ESP32.28
RGB-RED-1
  Top 0.254: ESP32.12 27.29,23.51 24.13,26.67 24.13,32 15.11,41.02 15.11,44.17 R17.1
RGB-RED-2
  Top 0.254: R14.1 56.87,36.3 55.12,34.92 55.12,29.21 52.07,26.04 49.91,26.04 ESP32.29
ROW1
  Top 0.254: ESP32.23 45.09,19.21 45.09,18.16 46.1,17.14 48.26,17.14 49.03,16.37 R15.1
ROW2
  Top 0.254: ESP32.24 46.37,18.18 46.35,18.16 46.74,17.78 48.39,17.78 49.91,16.26 49.91,13.34 49.66,13.08 R18.1
RX
  Top 0.254: USB-UART.7 12.43,15.22 12.9,15.7 30.48,15.7 | 30.48,15.7 30.91,15.7 | 50.03,32.26 ESP32.34 48.91,32.4 48.26,31.75 48.26,22.86 46.99,21.59 35.66,21.59 34.16,20.09 34.16,18.54 31.32,15.7 30.48,15.7
SERVO1
  Top 0.254: ESP32.37 49.91,36.2 52.07,36.2 52.45,36.58 52.45,50.67 51.56,51.56 19.18,51.56 16.51,54.23 SV1.3
SERVO2
  Top 0.254: ESP32.36 49.91,34.92 52.07,34.92 53.09,35.94 53.09,50.67 51.69,52.07 36.83,52.07 SV2.3
SERVO3
  Top 0.254: ESP32.31 52.05,28.59 52.07,28.57 53.72,30.23 53.72,52.96 SV3.3
SERVO4
  Top 0.254: ESP32.30 52.05,27.32 52.07,27.3 54.36,29.59 54.36,50.67 55.24,51.56 66.55,51.56 68.58,53.59 SV4.3
TX
  Top 0.254: USB-UART.10 11.08,15.74 11.08,15.75 11.59,16.26 31.11,16.26 33.76,18.9 33.76,20.26 35.49,21.99 46.76,21.99 47.75,22.99 47.75,32.51 48.9,33.66 49.88,33.66 ESP32.35
USB-RAW  (via drill 0.35)
  Top 0.254: L1.1 17.52,3.05 USB-RAW.1 13.31,3.05 13.26,3.1 | 13.26,3.1 C8.1 | v11.81,3.94 12.65,3.1 13.26,3.1
  Bottom 0.254: U$5.P$1 8.83,5.04 8.83,4.78 8.76,4.71 8.76,4.19 9.17,3.94 v11.81,3.94
USB-VCC
  Top 0.254: LED1.A 57.47,3.15 CHRG.4 55.63,5.05 C1.1 55.36,2.91 54.23,1.78 27.69,1.78 USB-VCC.1 24,5.08 23.37,4.45 L1.2 | L1.2 20.71,6.72 C10.1 20.57,6.86 20.57,8.13 17.65,11.05 11.79,11.05 11.57,11.27 11.57,11.69 USB-UART.4 | L1.2 20.71,2.38 C11.1
VBAT
  Top 0.254: 57.47,7.87 CHRG.3 | 57.47,7.87 57.47,9.85 58.42,10.79 62.87,10.79 VBAT.1 | 57.47,7.87 56.45,8.89 52.96,8.89 49.13,5.06 C3.1 42.13,5.06 LDO.1 41.42,5.77 41.08,5.77 40.91,5.93 40.91,6.76 41.08,6.93 41.42,6.93 LDO.3
  Bottom 0.254: LIPO.2 70.12,6.51 C2.1 70.08,4.04 VBAT.1
VCC  (via drill 0.35)
  Top 0.254: LDO.5 C5.1 | LDO.5 36.77,5.4 VCC.1 | 22.86,46.99 22.86,42.67 R6.2 29.32,36.21 ESP32.2 32.37,36.21 33.02,35.56 33.02,20.32 v30.48,17.78 | 22.86,46.99 21.84,48.01 U$4.P$1 | R5.2 52.17,22.86 56.39,22.86 57.53,21.59 | 57.53,21.59 57.53,15.75 53.09,11.18 37.47,11.18 36.98,10.69 36.83,10.69 36.83,10.16 | 57.53,21.59 57.53,33.53 64.77,40.01 64.77,47.12 63.88,48.01 U$1.P$1 | LDO.5 37.78,5.4 36.83,6.35 36.83,10.16 | 36.83,10.16 32.77,14.22 v32.77,15.24 | 3.43,34.67 WS2.1-VDD 3.81,34.58 | 3.81,34.58 2.54,33.31 2.54,28.82 C12.2 3.81,25.87 WS1.1-VDD 3.81,25.62 3.59,25.62 | 3.8,36.32 C13.2 | 3.8,36.32 3.81,34.58 | 22.86,46.99 22.86,48.13 21.34,49.66 6.73,49.66 3.93,46.85 C14.2 3.93,43.59 WS3.1-VDD 2.54,42.2 2.54,37.58 3.8,36.32
  Bottom 0.254: v32.77,15.24 30.48,17.53 v30.48,17.78
VCC-SERVO
  Top 0.254: BATT.1 72.39,55.88 71.12,57.15 67.31,57.15 66.04,55.88 | SV4.2 66.04,55.88 | 66.04,55.88 64.77,57.15 50.8,57.15 49.53,55.88 | SV3.2 49.53,55.88 | 49.53,55.88 48.26,57.15 33.02,57.15 31.75,55.88 | SV2.2 31.75,55.88 | 31.75,55.88 30.48,57.15 15.24,57.15 13.97,55.88 SV1.2
WS2812
  Top 0.254: R20.2 16.25,22.24 ESP32.13

### Text on the board
tNames: Fri3d Camp 2018 Badge prototype 1